# EAGLE schematic lighthouse-booster (EAGLE 8.3.2)
DESIGNER: JON NEWMAN; DESIGN_NAME: LIGHHOUSE SYNC. BOOSTER; LICENSE: CERN OHL v1.2; REVISION: 1.3
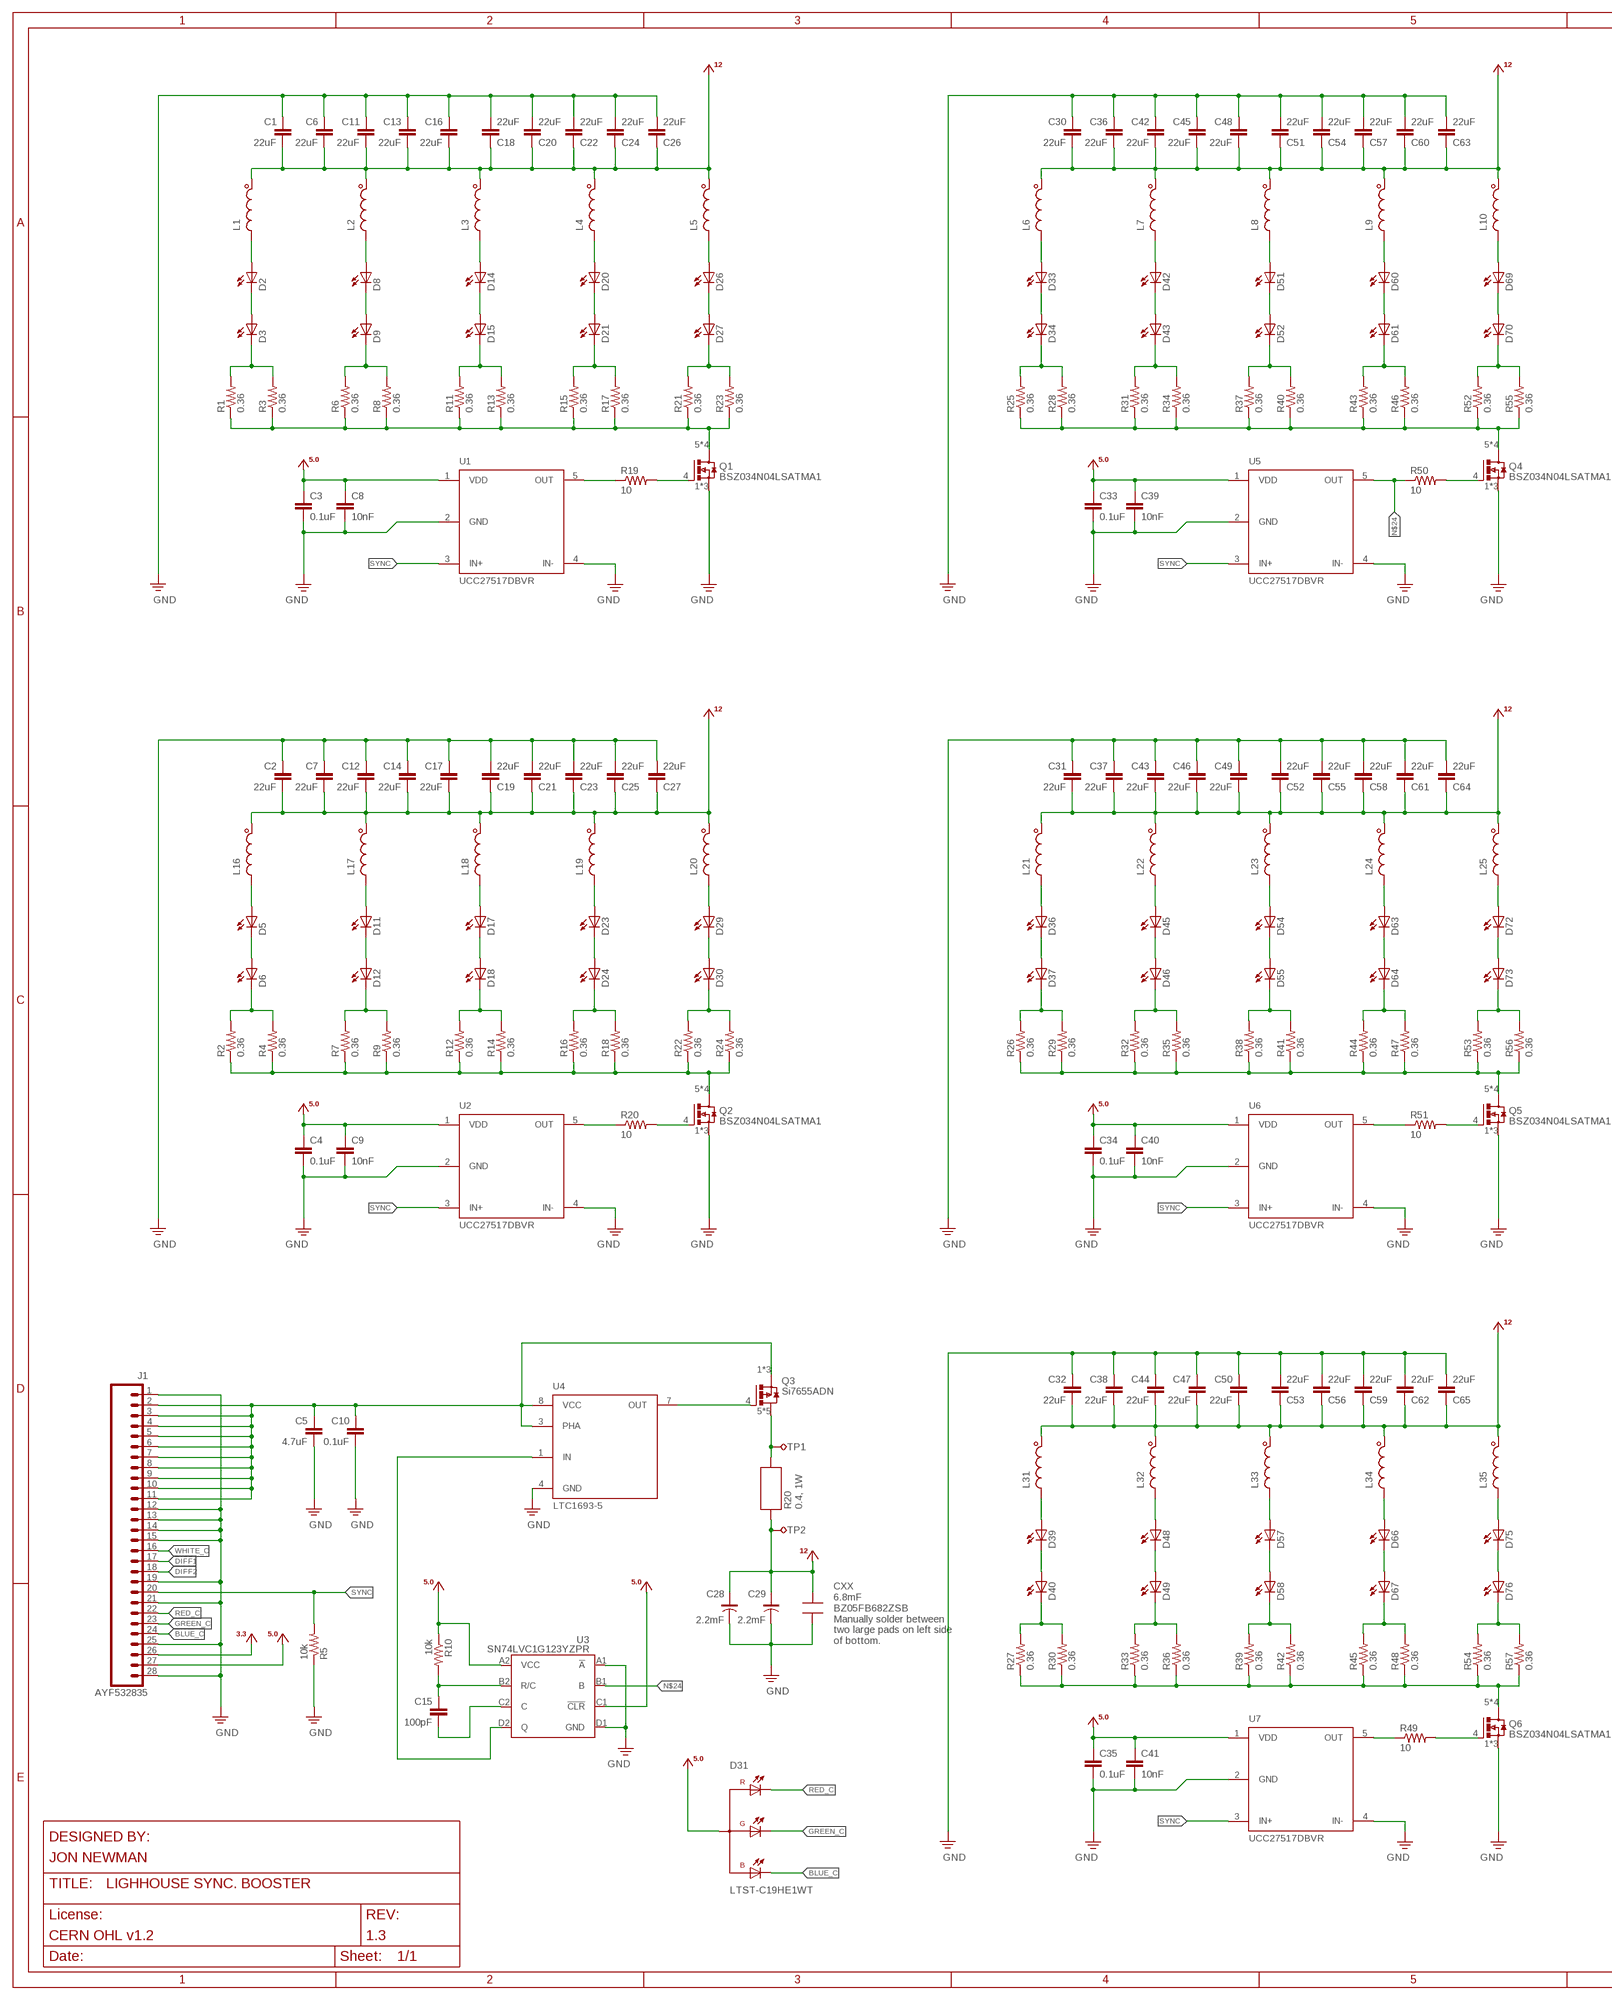
[diagram p0: schematic, sheet 1, part 1 of 2]
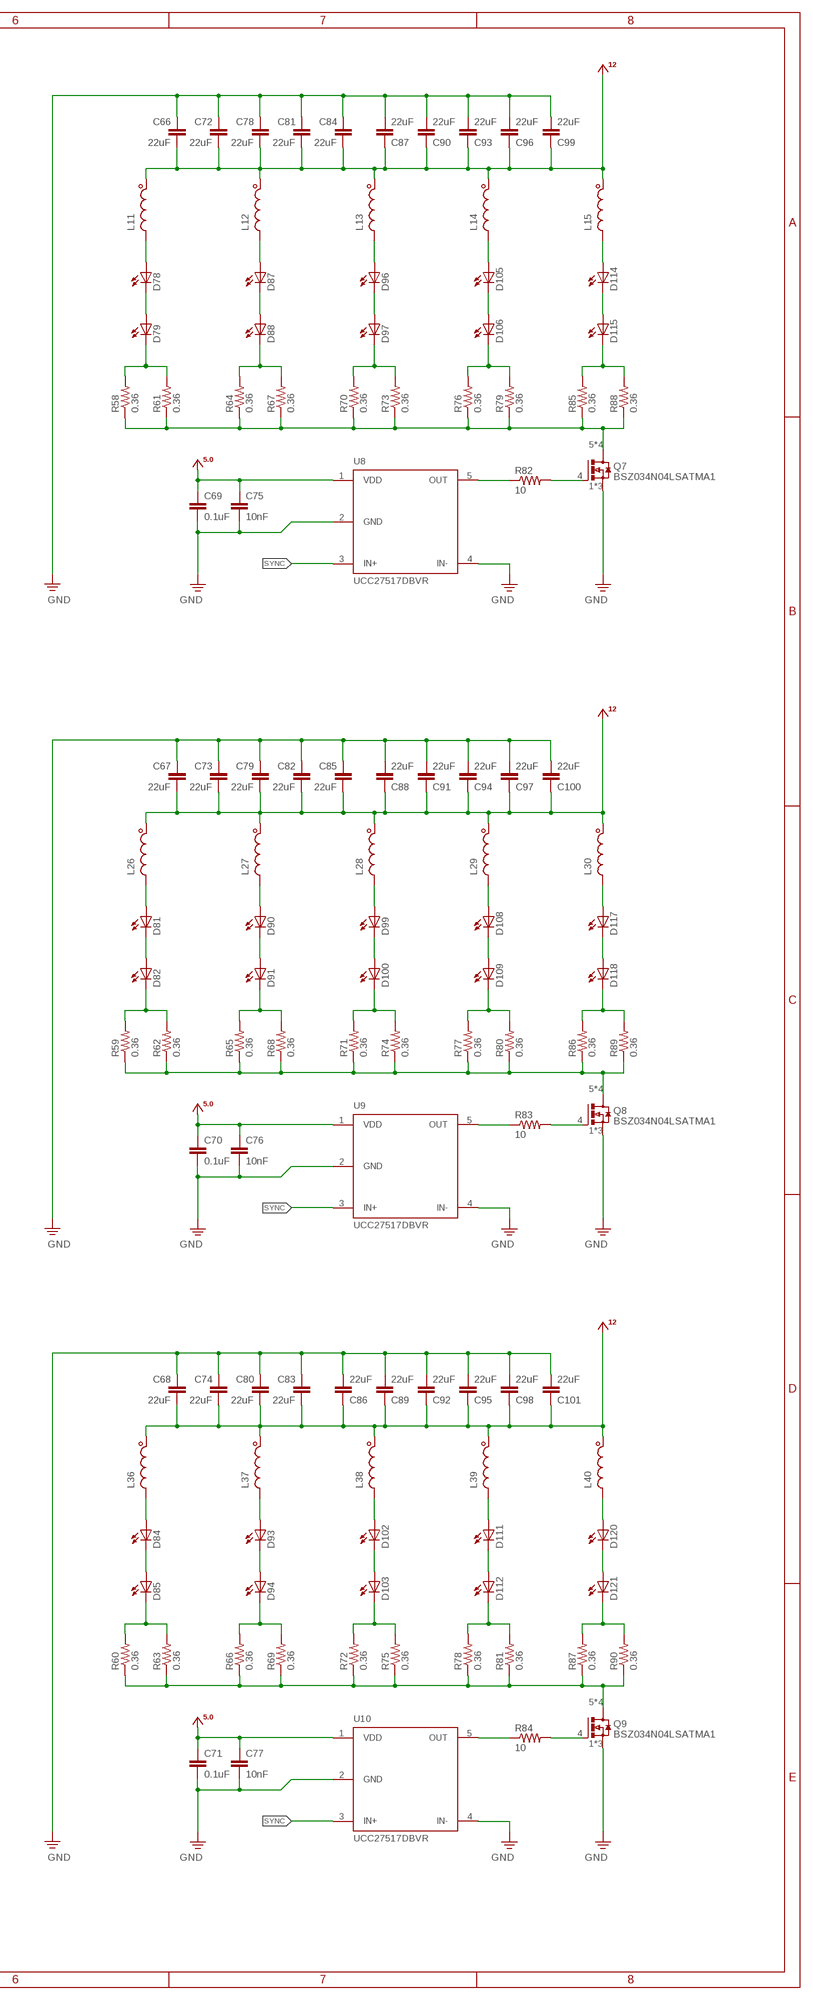
[diagram p1: schematic, sheet 1, part 2 of 2]

## Parts
C1  22uF  C_0805T  [0805T]
C2  22uF  C_0805T  [0805T]
C3  0.1uF  C_0402T  [0402T]
C4  0.1uF  C_0402T  [0402T]
C5  4.7uF  C_0603T  [0603T]
C6  22uF  C_0805T  [0805T]
C7  22uF  C_0805T  [0805T]
C8  10nF  C_0402T  [0402T]
C9  10nF  C_0402T  [0402T]
C10  0.1uF  C_0402T  [0402T]
C11  22uF  C_0805T  [0805T]
C12  22uF  C_0805T  [0805T]
C13  22uF  C_0805T  [0805T]
C14  22uF  C_0805T  [0805T]
C15  100pF  C_0402T  [0402T]
C16  22uF  C_0805T  [0805T]
C17  22uF  C_0805T  [0805T]
C18  22uF  C_0805T  [0805T]
C19  22uF  C_0805T  [0805T]
C20  22uF  C_0805T  [0805T]
C21  22uF  C_0805T  [0805T]
C22  22uF  C_0805T  [0805T]
C23  22uF  C_0805T  [0805T]
C24  22uF  C_0805T  [0805T]
C25  22uF  C_0805T  [0805T]
C26  22uF  C_0805T  [0805T]
C27  22uF  C_0805T  [0805T]
C28  2.2mF  C-POL_C5MMA-SMD  [C5MMA-SMD]
C29  2.2mF  C-POL_C5MMA-SMD  [C5MMA-SMD]
C30  22uF  C_0805T  [0805T]
C31  22uF  C_0805T  [0805T]
C32  22uF  C_0805T  [0805T]
C33  0.1uF  C_0402T  [0402T]
C34  0.1uF  C_0402T  [0402T]
C35  0.1uF  C_0402T  [0402T]
C36  22uF  C_0805T  [0805T]
C37  22uF  C_0805T  [0805T]
C38  22uF  C_0805T  [0805T]
C39  10nF  C_0402T  [0402T]
C40  10nF  C_0402T  [0402T]
C41  10nF  C_0402T  [0402T]
C42  22uF  C_0805T  [0805T]
C43  22uF  C_0805T  [0805T]
C44  22uF  C_0805T  [0805T]
C45  22uF  C_0805T  [0805T]
C46  22uF  C_0805T  [0805T]
C47  22uF  C_0805T  [0805T]
C48  22uF  C_0805T  [0805T]
C49  22uF  C_0805T  [0805T]
C50  22uF  C_0805T  [0805T]
C51  22uF  C_0805T  [0805T]
C52  22uF  C_0805T  [0805T]
C53  22uF  C_0805T  [0805T]
C54  22uF  C_0805T  [0805T]
C55  22uF  C_0805T  [0805T]
C56  22uF  C_0805T  [0805T]
C57  22uF  C_0805T  [0805T]
C58  22uF  C_0805T  [0805T]
C59  22uF  C_0805T  [0805T]
C60  22uF  C_0805T  [0805T]
C61  22uF  C_0805T  [0805T]
C62  22uF  C_0805T  [0805T]
C63  22uF  C_0805T  [0805T]
C64  22uF  C_0805T  [0805T]
C65  22uF  C_0805T  [0805T]
C66  22uF  C_0805T  [0805T]
C67  22uF  C_0805T  [0805T]
C68  22uF  C_0805T  [0805T]
C69  0.1uF  C_0402T  [0402T]
C70  0.1uF  C_0402T  [0402T]
C71  0.1uF  C_0402T  [0402T]
C72  22uF  C_0805T  [0805T]
C73  22uF  C_0805T  [0805T]
C74  22uF  C_0805T  [0805T]
C75  10nF  C_0402T  [0402T]
C76  10nF  C_0402T  [0402T]
C77  10nF  C_0402T  [0402T]
C78  22uF  C_0805T  [0805T]
C79  22uF  C_0805T  [0805T]
C80  22uF  C_0805T  [0805T]
C81  22uF  C_0805T  [0805T]
C82  22uF  C_0805T  [0805T]
C83  22uF  C_0805T  [0805T]
C84  22uF  C_0805T  [0805T]
C85  22uF  C_0805T  [0805T]
C86  22uF  C_0805T  [0805T]
C87  22uF  C_0805T  [0805T]
C88  22uF  C_0805T  [0805T]
C89  22uF  C_0805T  [0805T]
C90  22uF  C_0805T  [0805T]
C91  22uF  C_0805T  [0805T]
C92  22uF  C_0805T  [0805T]
C93  22uF  C_0805T  [0805T]
C94  22uF  C_0805T  [0805T]
C95  22uF  C_0805T  [0805T]
C96  22uF  C_0805T  [0805T]
C97  22uF  C_0805T  [0805T]
C98  22uF  C_0805T  [0805T]
C99  22uF  C_0805T  [0805T]
C100  22uF  C_0805T  [0805T]
C101  22uF  C_0805T  [0805T]
D2  LED_LUXEON-3.7MM  [LUXEON-3.7MM]
D3  LED_LUXEON-3.7MM  [LUXEON-3.7MM]
D5  LED_LUXEON-3.7MM  [LUXEON-3.7MM]
D6  LED_LUXEON-3.7MM  [LUXEON-3.7MM]
D8  LED_LUXEON-3.7MM  [LUXEON-3.7MM]
D9  LED_LUXEON-3.7MM  [LUXEON-3.7MM]
D11  LED_LUXEON-3.7MM  [LUXEON-3.7MM]
D12  LED_LUXEON-3.7MM  [LUXEON-3.7MM]
D14  LED_LUXEON-3.7MM  [LUXEON-3.7MM]
D15  LED_LUXEON-3.7MM  [LUXEON-3.7MM]
D17  LED_LUXEON-3.7MM  [LUXEON-3.7MM]
D18  LED_LUXEON-3.7MM  [LUXEON-3.7MM]
D20  LED_LUXEON-3.7MM  [LUXEON-3.7MM]
D21  LED_LUXEON-3.7MM  [LUXEON-3.7MM]
D23  LED_LUXEON-3.7MM  [LUXEON-3.7MM]
D24  LED_LUXEON-3.7MM  [LUXEON-3.7MM]
D26  LED_LUXEON-3.7MM  [LUXEON-3.7MM]
D27  LED_LUXEON-3.7MM  [LUXEON-3.7MM]
D29  LED_LUXEON-3.7MM  [LUXEON-3.7MM]
D30  LED_LUXEON-3.7MM  [LUXEON-3.7MM]
D31  LTST-C19HE1WT  LED-RGB_LTST  [LTST-C19HE1WT]
D33  LED_LUXEON-3.7MM  [LUXEON-3.7MM]
D34  LED_LUXEON-3.7MM  [LUXEON-3.7MM]
D36  LED_LUXEON-3.7MM  [LUXEON-3.7MM]
D37  LED_LUXEON-3.7MM  [LUXEON-3.7MM]
D39  LED_LUXEON-3.7MM  [LUXEON-3.7MM]
D40  LED_LUXEON-3.7MM  [LUXEON-3.7MM]
D42  LED_LUXEON-3.7MM  [LUXEON-3.7MM]
D43  LED_LUXEON-3.7MM  [LUXEON-3.7MM]
D45  LED_LUXEON-3.7MM  [LUXEON-3.7MM]
D46  LED_LUXEON-3.7MM  [LUXEON-3.7MM]
D48  LED_LUXEON-3.7MM  [LUXEON-3.7MM]
D49  LED_LUXEON-3.7MM  [LUXEON-3.7MM]
D51  LED_LUXEON-3.7MM  [LUXEON-3.7MM]
D52  LED_LUXEON-3.7MM  [LUXEON-3.7MM]
D54  LED_LUXEON-3.7MM  [LUXEON-3.7MM]
D55  LED_LUXEON-3.7MM  [LUXEON-3.7MM]
D57  LED_LUXEON-3.7MM  [LUXEON-3.7MM]
D58  LED_LUXEON-3.7MM  [LUXEON-3.7MM]
D60  LED_LUXEON-3.7MM  [LUXEON-3.7MM]
D61  LED_LUXEON-3.7MM  [LUXEON-3.7MM]
D63  LED_LUXEON-3.7MM  [LUXEON-3.7MM]
D64  LED_LUXEON-3.7MM  [LUXEON-3.7MM]
D66  LED_LUXEON-3.7MM  [LUXEON-3.7MM]
D67  LED_LUXEON-3.7MM  [LUXEON-3.7MM]
D69  LED_LUXEON-3.7MM  [LUXEON-3.7MM]
D70  LED_LUXEON-3.7MM  [LUXEON-3.7MM]
D72  LED_LUXEON-3.7MM  [LUXEON-3.7MM]
D73  LED_LUXEON-3.7MM  [LUXEON-3.7MM]
D75  LED_LUXEON-3.7MM  [LUXEON-3.7MM]
D76  LED_LUXEON-3.7MM  [LUXEON-3.7MM]
D78  LED_LUXEON-3.7MM  [LUXEON-3.7MM]
D79  LED_LUXEON-3.7MM  [LUXEON-3.7MM]
D81  LED_LUXEON-3.7MM  [LUXEON-3.7MM]
D82  LED_LUXEON-3.7MM  [LUXEON-3.7MM]
D84  LED_LUXEON-3.7MM  [LUXEON-3.7MM]
D85  LED_LUXEON-3.7MM  [LUXEON-3.7MM]
D87  LED_LUXEON-3.7MM  [LUXEON-3.7MM]
D88  LED_LUXEON-3.7MM  [LUXEON-3.7MM]
D90  LED_LUXEON-3.7MM  [LUXEON-3.7MM]
D91  LED_LUXEON-3.7MM  [LUXEON-3.7MM]
D93  LED_LUXEON-3.7MM  [LUXEON-3.7MM]
D94  LED_LUXEON-3.7MM  [LUXEON-3.7MM]
D96  LED_LUXEON-3.7MM  [LUXEON-3.7MM]
D97  LED_LUXEON-3.7MM  [LUXEON-3.7MM]
D99  LED_LUXEON-3.7MM  [LUXEON-3.7MM]
D100  LED_LUXEON-3.7MM  [LUXEON-3.7MM]
D102  LED_LUXEON-3.7MM  [LUXEON-3.7MM]
D103  LED_LUXEON-3.7MM  [LUXEON-3.7MM]
D105  LED_LUXEON-3.7MM  [LUXEON-3.7MM]
D106  LED_LUXEON-3.7MM  [LUXEON-3.7MM]
D108  LED_LUXEON-3.7MM  [LUXEON-3.7MM]
D109  LED_LUXEON-3.7MM  [LUXEON-3.7MM]
D111  LED_LUXEON-3.7MM  [LUXEON-3.7MM]
D112  LED_LUXEON-3.7MM  [LUXEON-3.7MM]
D114  LED_LUXEON-3.7MM  [LUXEON-3.7MM]
D115  LED_LUXEON-3.7MM  [LUXEON-3.7MM]
D117  LED_LUXEON-3.7MM  [LUXEON-3.7MM]
D118  LED_LUXEON-3.7MM  [LUXEON-3.7MM]
D120  LED_LUXEON-3.7MM  [LUXEON-3.7MM]
D121  LED_LUXEON-3.7MM  [LUXEON-3.7MM]
J1  AYF532835  PINHD-1X28_Y5B  [Y5B/Y5BW-28]
L1  L_0805T  [0805T]
L2  L_0805T  [0805T]
L3  L_0805T  [0805T]
L4  L_0805T  [0805T]
L5  L_0805T  [0805T]
L6  L_0805T  [0805T]
L7  L_0805T  [0805T]
L8  L_0805T  [0805T]
L9  L_0805T  [0805T]
L10  L_0805T  [0805T]
L11  L_0805T  [0805T]
L12  L_0805T  [0805T]
L13  L_0805T  [0805T]
L14  L_0805T  [0805T]
L15  L_0805T  [0805T]
L16  L_0805T  [0805T]
L17  L_0805T  [0805T]
L18  L_0805T  [0805T]
L19  L_0805T  [0805T]
L20  L_0805T  [0805T]
L21  L_0805T  [0805T]
L22  L_0805T  [0805T]
L23  L_0805T  [0805T]
L24  L_0805T  [0805T]
L25  L_0805T  [0805T]
L26  L_0805T  [0805T]
L27  L_0805T  [0805T]
L28  L_0805T  [0805T]
L29  L_0805T  [0805T]
L30  L_0805T  [0805T]
L31  L_0805T  [0805T]
L32  L_0805T  [0805T]
L33  L_0805T  [0805T]
L34  L_0805T  [0805T]
L35  L_0805T  [0805T]
L36  L_0805T  [0805T]
L37  L_0805T  [0805T]
L38  L_0805T  [0805T]
L39  L_0805T  [0805T]
L40  L_0805T  [0805T]
Q1  BSZ034N04LSATMA1  N-MOSFET_TSDSON-8  [PG-TSDSON-8]
Q2  BSZ034N04LSATMA1  N-MOSFET_TSDSON-8  [PG-TSDSON-8]
Q3  Si7655ADN  P-MOSFET_POWERPACK-1212-8  [POWERPACK-1212-8]
Q4  BSZ034N04LSATMA1  N-MOSFET_TSDSON-8  [PG-TSDSON-8]
Q5  BSZ034N04LSATMA1  N-MOSFET_TSDSON-8  [PG-TSDSON-8]
Q6  BSZ034N04LSATMA1  N-MOSFET_TSDSON-8  [PG-TSDSON-8]
Q7  BSZ034N04LSATMA1  N-MOSFET_TSDSON-8  [PG-TSDSON-8]
Q8  BSZ034N04LSATMA1  N-MOSFET_TSDSON-8  [PG-TSDSON-8]
Q9  BSZ034N04LSATMA1  N-MOSFET_TSDSON-8  [PG-TSDSON-8]
R1  0.36  R_0805T  [0805T]
R2  0.36  R_0805T  [0805T]
R3  0.36  R_0805T  [0805T]
R4  0.36  R_0805T  [0805T]
R5  10k  R_0402T  [0402T]
R6  0.36  R_0805T  [0805T]
R7  0.36  R_0805T  [0805T]
R8  0.36  R_0805T  [0805T]
R9  0.36  R_0805T  [0805T]
R10  10k  R_0402T  [0402T]
R11  0.36  R_0805T  [0805T]
R12  0.36  R_0805T  [0805T]
R13  0.36  R_0805T  [0805T]
R14  0.36  R_0805T  [0805T]
R15  0.36  R_0805T  [0805T]
R16  0.36  R_0805T  [0805T]
R17  0.36  R_0805T  [0805T]
R18  0.36  R_0805T  [0805T]
R19  10  R_0402T  [0402T]
R20  10  R_0402T  [0402T]
R21  0.36  R_0805T  [0805T]
R22  0.36  R_0805T  [0805T]
R23  0.36  R_0805T  [0805T]
R24  0.36  R_0805T  [0805T]
R25  0.36  R_0805T  [0805T]
R26  0.36  R_0805T  [0805T]
R27  0.36  R_0805T  [0805T]
R28  0.36  R_0805T  [0805T]
R29  0.36  R_0805T  [0805T]
R30  0.36  R_0805T  [0805T]
R31  0.36  R_0805T  [0805T]
R32  0.36  R_0805T  [0805T]
R33  0.36  R_0805T  [0805T]
R34  0.36  R_0805T  [0805T]
R35  0.36  R_0805T  [0805T]
R36  0.36  R_0805T  [0805T]
R37  0.36  R_0805T  [0805T]
R38  0.36  R_0805T  [0805T]
R39  0.36  R_0805T  [0805T]
R40  0.36  R_0805T  [0805T]
R41  0.36  R_0805T  [0805T]
R42  0.36  R_0805T  [0805T]
R43  0.36  R_0805T  [0805T]
R44  0.36  R_0805T  [0805T]
R45  0.36  R_0805T  [0805T]
R46  0.36  R_0805T  [0805T]
R47  0.36  R_0805T  [0805T]
R48  0.36  R_0805T  [0805T]
R49  10  R_0402T  [0402T]
R50  10  R_0402T  [0402T]
R51  10  R_0402T  [0402T]
R52  0.36  R_0805T  [0805T]
R53  0.36  R_0805T  [0805T]
R54  0.36  R_0805T  [0805T]
R55  0.36  R_0805T  [0805T]
R56  0.36  R_0805T  [0805T]
R57  0.36  R_0805T  [0805T]
R58  0.36  R_0805T  [0805T]
R59  0.36  R_0805T  [0805T]
R60  0.36  R_0805T  [0805T]
R61  0.36  R_0805T  [0805T]
R62  0.36  R_0805T  [0805T]
R63  0.36  R_0805T  [0805T]
R64  0.36  R_0805T  [0805T]
R65  0.36  R_0805T  [0805T]
R66  0.36  R_0805T  [0805T]
R67  0.36  R_0805T  [0805T]
R68  0.36  R_0805T  [0805T]
R69  0.36  R_0805T  [0805T]
R70  0.36  R_0805T  [0805T]
R71  0.36  R_0805T  [0805T]
R72  0.36  R_0805T  [0805T]
R73  0.36  R_0805T  [0805T]
R74  0.36  R_0805T  [0805T]
R75  0.36  R_0805T  [0805T]
R76  0.36  R_0805T  [0805T]
R77  0.36  R_0805T  [0805T]
R78  0.36  R_0805T  [0805T]
R79  0.36  R_0805T  [0805T]
R80  0.36  R_0805T  [0805T]
R81  0.36  R_0805T  [0805T]
R82  10  R_0402T  [0402T]
R83  10  R_0402T  [0402T]
R84  10  R_0402T  [0402T]
R85  0.36  R_0805T  [0805T]
R86  0.36  R_0805T  [0805T]
R87  0.36  R_0805T  [0805T]
R88  0.36  R_0805T  [0805T]
R89  0.36  R_0805T  [0805T]
R90  0.36  R_0805T  [0805T]
TP1  TPTP18SQ  [TP18SQ]
TP2  TPTP18SQ  [TP18SQ]
U1  UCC27517DBVR  UCC27517_SOT  [SOT-23-5]
U2  UCC27517DBVR  UCC27517_SOT  [SOT-23-5]
U3  SN74LVC1G123YZPR  MONOSTABLE-MULTIVIBRATOR_DSBGA  [DSBGA8-1.9X0.9MM]
U4  LTC1693-5  LTC1693_MSOP  [MSOP-8-3X3]
U5  UCC27517DBVR  UCC27517_SOT  [SOT-23-5]
U6  UCC27517DBVR  UCC27517_SOT  [SOT-23-5]
U7  UCC27517DBVR  UCC27517_SOT  [SOT-23-5]
U8  UCC27517DBVR  UCC27517_SOT  [SOT-23-5]
U9  UCC27517DBVR  UCC27517_SOT  [SOT-23-5]
U10  UCC27517DBVR  UCC27517_SOT  [SOT-23-5]

## Nets
+3V3: J1.26
+5V0: C3.1 C4.1 C8.1 C9.1 C33.1 C34.1 C35.1 C39.1 C40.1 C41.1 C69.1 C70.1 C71.1 C75.1 C76.1 C77.1 D31.4(A) J1.27 R10.1 U1.1(VDD) U2.1(VDD) U3.A2(VCC) U3.C1(!CLR) U5.1(VDD) U6.1(VDD) U7.1(VDD) U8.1(VDD) U9.1(VDD) U10.1(VDD)
+12V: C1.2 C2.2 C6.2 C7.2 C11.2 C12.2 C13.2 C14.2 C16.2 C17.2 C18.1 C19.1 C20.1 C21.1 C22.1 C23.1 C24.1 C25.1 C26.1 C27.1 C28.A(+) C29.A(+) C30.2 C31.2 C32.2 C36.2 C37.2 C38.2 C42.2 C43.2 C44.2 C45.2 C46.2 C47.2 C48.2 C49.2 C50.2 C51.1 C52.1 C53.1 C54.1 C55.1 C56.1 C57.1 C58.1 C59.1 C60.1 C61.1 C62.1 C63.1 C64.1 C65.1 C66.2 C67.2 C68.2 C72.2 C73.2 C74.2 C78.2 C79.2 C80.2 C81.2 C82.2 C83.2 C84.2 C85.2 C86.1 C87.1 C88.1 C89.1 C90.1 C91.1 C92.1 C93.1 C94.1 C95.1 C96.1 C97.1 C98.1 C99.1 C100.1 C101.1 L1.1 L2.1 L3.1 L4.1 L5.1 L6.1 L7.1 L8.1 L9.1 L10.1 L11.1 L12.1 L13.1 L14.1 L15.1 L16.1 L17.1 L18.1 L19.1 L20.1 L21.1 L22.1 L23.1 L24.1 L25.1 L26.1 L27.1 L28.1 L29.1 L30.1 L31.1 L32.1 L33.1 L34.1 L35.1 L36.1 L37.1 L38.1 L39.1 L40.1 TP2.TP
BLUE_C: D31.3(CB) J1.24
DIFF1: J1.17
DIFF2: J1.18
GND: C1.1 C2.1 C3.2 C4.2 C5.2 C6.1 C7.1 C8.2 C9.2 C10.2 C11.1 C12.1 C13.1 C14.1 C16.1 C17.1 C18.2 C19.2 C20.2 C21.2 C22.2 C23.2 C24.2 C25.2 C26.2 C27.2 C28.C(-) C29.C(-) C30.1 C31.1 C32.1 C33.2 C34.2 C35.2 C36.1 C37.1 C38.1 C39.2 C40.2 C41.2 C42.1 C43.1 C44.1 C45.1 C46.1 C47.1 C48.1 C49.1 C50.1 C51.2 C52.2 C53.2 C54.2 C55.2 C56.2 C57.2 C58.2 C59.2 C60.2 C61.2 C62.2 C63.2 C64.2 C65.2 C66.1 C67.1 C68.1 C69.2 C70.2 C71.2 C72.1 C73.1 C74.1 C75.2 C76.2 C77.2 C78.1 C79.1 C80.1 C81.1 C82.1 C83.1 C84.1 C85.1 C86.2 C87.2 C88.2 C89.2 C90.2 C91.2 C92.2 C93.2 C94.2 C95.2 C96.2 C97.2 C98.2 C99.2 C100.2 C101.2 J1.1 J1.12 J1.13 J1.14 J1.15 J1.19 J1.21 J1.25 J1.28 Q1.1(S) Q1.2(S) Q1.3(S) Q2.1(S) Q2.2(S) Q2.3(S) Q4.1(S) Q4.2(S) Q4.3(S) Q5.1(S) Q5.2(S) Q5.3(S) Q6.1(S) Q6.2(S) Q6.3(S) Q7.1(S) Q7.2(S) Q7.3(S) Q8.1(S) Q8.2(S) Q8.3(S) Q9.1(S) Q9.2(S) Q9.3(S) R5.1 U1.2(GND) U1.4(IN-) U2.2(GND) U2.4(IN-) U3.A1(!A) U3.D1(GND) U4.4(GND) U5.2(GND) U5.4(IN-) U6.2(GND) U6.4(IN-) U7.2(GND) U7.4(IN-) U8.2(GND) U8.4(IN-) U9.2(GND) U9.4(IN-) U10.2(GND) U10.4(IN-)
GREEN_C: D31.2(CG) J1.23
N$1: D76.C R54.2 R57.2
N$2: D75.C D76.A1(A) D76.A2(A)
N$3: D75.A1(A) D75.A2(A) L35.2
N$4: Q6.5(D) Q6.6(D) Q6.7(D) Q6.8(D) R27.1 R30.1 R33.1 R36.1 R39.1 R42.1 R45.1 R48.1 R54.1 R57.1
N$5: R49.1 U7.5(OUT)
N$6: D58.C R39.2 R42.2
N$7: D57.C D58.A1(A) D58.A2(A)
N$8: D67.C R45.2 R48.2
N$9: D66.C D67.A1(A) D67.A2(A)
N$10: D66.A1(A) D66.A2(A) L34.2
N$11: D30.C R22.2 R24.2
N$12: D57.A1(A) D57.A2(A) L33.2
N$13: D49.C R33.2 R36.2
N$14: D48.C D49.A1(A) D49.A2(A)
N$15: D48.A1(A) D48.A2(A) L32.2
N$16: D40.C R27.2 R30.2
N$17: D39.C D40.A1(A) D40.A2(A)
N$18: D39.A1(A) D39.A2(A) L31.2
N$19: D29.C D30.A1(A) D30.A2(A)
N$20: D29.A1(A) D29.A2(A) L20.2
N$21: Q2.5(D) Q2.6(D) Q2.7(D) Q2.8(D) R2.1 R4.1 R7.1 R9.1 R12.1 R14.1 R16.1 R18.1 R22.1 R24.1
N$22: R82.1 U8.5(OUT)
N$23: Q6.4(G) R49.2
N$24: R50.1 U3.B1(B) U5.5(OUT)
N$25: Q1.4(G) R19.2
N$26: R20.1 U2.5(OUT)
N$27: Q5.4(G) R51.2
N$28: R83.1 U9.5(OUT)
N$29: D24.C R16.2 R18.2
N$30: D23.C D24.A1(A) D24.A2(A)
N$31: D23.A1(A) D23.A2(A) L19.2
N$32: D18.C R12.2 R14.2
N$33: D17.C D18.A1(A) D18.A2(A)
N$34: D17.A1(A) D17.A2(A) L18.2
N$35: D12.C R7.2 R9.2
N$36: D11.C D12.A1(A) D12.A2(A)
N$37: D11.A1(A) D11.A2(A) L17.2
N$38: D6.C R2.2 R4.2
N$39: D5.C D6.A1(A) D6.A2(A)
N$40: D5.A1(A) D5.A2(A) L16.2
N$41: Q2.4(G) R20.2
N$42: R84.1 U10.5(OUT)
N$43: C15.1 R10.2 U3.B2(R/C)
N$44: U3.D2(Q) U4.1(IN)
N$45: C15.2 U3.C2(C)
N$46: C5.1 C10.1 J1.2 J1.3 J1.4 J1.5 J1.6 J1.7 J1.8 J1.9 J1.10 J1.11 Q3.1(S) Q3.2(S) Q3.3(S) U4.3(PHA) U4.8(VCC)
N$47: D27.C R21.2 R23.2
N$48: D26.C D27.A1(A) D27.A2(A)
N$49: D26.A1(A) D26.A2(A) L5.2
N$50: Q1.5(D) Q1.6(D) Q1.7(D) Q1.8(D) R1.1 R3.1 R6.1 R8.1 R11.1 R13.1 R15.1 R17.1 R21.1 R23.1
N$51: Q3.5(D) Q3.6(D) Q3.7(D) Q3.8(D) Q3.PAD(D) TP1.TP
N$52: D21.C R15.2 R17.2
N$53: D20.C D21.A1(A) D21.A2(A)
N$54: D20.A1(A) D20.A2(A) L4.2
N$55: D15.C R11.2 R13.2
N$56: D14.C D15.A1(A) D15.A2(A)
N$57: D14.A1(A) D14.A2(A) L3.2
N$58: D9.C R6.2 R8.2
N$59: D8.C D9.A1(A) D9.A2(A)
N$60: D8.A1(A) D8.A2(A) L2.2
N$61: D3.C R1.2 R3.2
N$62: D2.C D3.A1(A) D3.A2(A)
N$63: D2.A1(A) D2.A2(A) L1.2
N$64: R19.1 U1.5(OUT)
N$66: Q3.4(G) U4.7(OUT)
N$70: D70.C R52.2 R55.2
N$71: D69.C D70.A1(A) D70.A2(A)
N$72: D69.A1(A) D69.A2(A) L10.2
N$73: Q4.5(D) Q4.6(D) Q4.7(D) Q4.8(D) R25.1 R28.1 R31.1 R34.1 R37.1 R40.1 R43.1 R46.1 R52.1 R55.1
N$75: D61.C R43.2 R46.2
N$76: D60.C D61.A1(A) D61.A2(A)
N$77: D60.A1(A) D60.A2(A) L9.2
N$78: D52.C R37.2 R40.2
N$79: D51.C D52.A1(A) D52.A2(A)
N$80: D51.A1(A) D51.A2(A) L8.2
N$81: D43.C R31.2 R34.2
N$82: D42.C D43.A1(A) D43.A2(A)
N$83: D42.A1(A) D42.A2(A) L7.2
N$84: D34.C R25.2 R28.2
N$85: D33.C D34.A1(A) D34.A2(A)
N$86: D33.A1(A) D33.A2(A) L6.2
N$87: Q4.4(G) R50.2
N$93: D115.C R85.2 R88.2
N$94: D114.C D115.A1(A) D115.A2(A)
N$95: D114.A1(A) D114.A2(A) L15.2
N$96: Q7.5(D) Q7.6(D) Q7.7(D) Q7.8(D) R58.1 R61.1 R64.1 R67.1 R70.1 R73.1 R76.1 R79.1 R85.1 R88.1
N$98: D106.C R76.2 R79.2
N$99: D105.C D106.A1(A) D106.A2(A)
N$100: D105.A1(A) D105.A2(A) L14.2
N$101: D97.C R70.2 R73.2
N$102: D96.C D97.A1(A) D97.A2(A)
N$103: D96.A1(A) D96.A2(A) L13.2
N$104: D88.C R64.2 R67.2
N$105: D87.C D88.A1(A) D88.A2(A)
N$106: D87.A1(A) D87.A2(A) L12.2
N$107: D79.C R58.2 R61.2
N$108: D78.C D79.A1(A) D79.A2(A)
N$109: D78.A1(A) D78.A2(A) L11.2
N$110: Q7.4(G) R82.2
N$116: D73.C R53.2 R56.2
N$117: D72.C D73.A1(A) D73.A2(A)
N$118: D72.A1(A) D72.A2(A) L25.2
N$119: Q5.5(D) Q5.6(D) Q5.7(D) Q5.8(D) R26.1 R29.1 R32.1 R35.1 R38.1 R41.1 R44.1 R47.1 R53.1 R56.1
N$121: D64.C R44.2 R47.2
N$122: D63.C D64.A1(A) D64.A2(A)
N$123: D63.A1(A) D63.A2(A) L24.2
N$124: D55.C R38.2 R41.2
N$125: D54.C D55.A1(A) D55.A2(A)
N$126: D54.A1(A) D54.A2(A) L23.2
N$127: D46.C R32.2 R35.2
N$128: D45.C D46.A1(A) D46.A2(A)
N$129: D45.A1(A) D45.A2(A) L22.2
N$130: D37.C R26.2 R29.2
N$131: D36.C D37.A1(A) D37.A2(A)
N$132: D36.A1(A) D36.A2(A) L21.2
N$133: R51.1 U6.5(OUT)
N$139: D118.C R86.2 R89.2
N$140: D117.C D118.A1(A) D118.A2(A)
N$141: D117.A1(A) D117.A2(A) L30.2
N$142: Q8.5(D) Q8.6(D) Q8.7(D) Q8.8(D) R59.1 R62.1 R65.1 R68.1 R71.1 R74.1 R77.1 R80.1 R86.1 R89.1
N$144: D109.C R77.2 R80.2
N$145: D108.C D109.A1(A) D109.A2(A)
N$146: D108.A1(A) D108.A2(A) L29.2
N$147: D100.C R71.2 R74.2
N$148: D99.C D100.A1(A) D100.A2(A)
N$149: D99.A1(A) D99.A2(A) L28.2
N$150: D91.C R65.2 R68.2
N$151: D90.C D91.A1(A) D91.A2(A)
N$152: D90.A1(A) D90.A2(A) L27.2
N$153: D82.C R59.2 R62.2
N$154: D81.C D82.A1(A) D82.A2(A)
N$155: D81.A1(A) D81.A2(A) L26.2
N$156: Q8.4(G) R83.2
N$162: D121.C R87.2 R90.2
N$163: D120.C D121.A1(A) D121.A2(A)
N$164: D120.A1(A) D120.A2(A) L40.2
N$165: Q9.5(D) Q9.6(D) Q9.7(D) Q9.8(D) R60.1 R63.1 R66.1 R69.1 R72.1 R75.1 R78.1 R81.1 R87.1 R90.1
N$167: D112.C R78.2 R81.2
N$168: D111.C D112.A1(A) D112.A2(A)
N$169: D111.A1(A) D111.A2(A) L39.2
N$170: D103.C R72.2 R75.2
N$171: D102.C D103.A1(A) D103.A2(A)
N$172: D102.A1(A) D102.A2(A) L38.2
N$173: D94.C R66.2 R69.2
N$174: D93.C D94.A1(A) D94.A2(A)
N$175: D93.A1(A) D93.A2(A) L37.2
N$176: D85.C R60.2 R63.2
N$177: D84.C D85.A1(A) D85.A2(A)
N$178: D84.A1(A) D84.A2(A) L36.2
N$179: Q9.4(G) R84.2
RED_C: D31.1(CR) J1.22
SYNC: J1.20 R5.2 U1.3(IN+) U2.3(IN+) U5.3(IN+) U6.3(IN+) U7.3(IN+) U8.3(IN+) U9.3(IN+) U10.3(IN+)
WHITE_C: J1.16

## Notes on the sheet
- R20
  0.4, 1W
- CXX
  6.8mF
  BZ05FB682ZSB
  Manually solder between
  two large pads on left side
  of bottom.

## Library data of the parts
C1-C27 C30-C101 = jonnew:C: Capacitor
C28 C29 = jonnew:C-POL: Polarized Capacitor
D2 D3 D5 D6 D8 D9 D11 D12 D14 D15 D17 D18 D20 D21 D23 D24 D26 D27 D29 D30 D33 D34 D36 D37 D39 D40 D42 D43 D45 D46 D48 D49 D51 D52 D54 D55 D57 D58 D60 D61 D63 D64 D66 D67 D69 D70 D72 D73 D75 D76 D78 D79 D81 D82 D84 D85 D87 D88 D90 D91 D93 D94 D96 D97 D99 D100 D102 D103 D105 D106 D108 D109 D111 D112 D114 D115 D117 D118 D120 D121 = jonnew:LED: Surface mount LED
D31 = jonnew:LED-RGB
J1 = jonnew:PINHD-1X28
L1-L40 = jonnew:L: Inductor
Q1 Q2 Q4-Q9 = jonnew:N-MOSFET: N-CHANNEL MOS FET SYMBOL
Q3 = jonnew:P-MOSFET
R1-R90 = jonnew:R: Resistor
TP1 TP2 = jonnew:TP: Test pad
U1 U2 U5-U10 = jonnew:UCC27517
U3 = jonnew:MONOSTABLE-MULTIVIBRATOR
U4 = jonnew:LTC1693